# Altium project EVSE_Controller_v0.1.PrjPcb
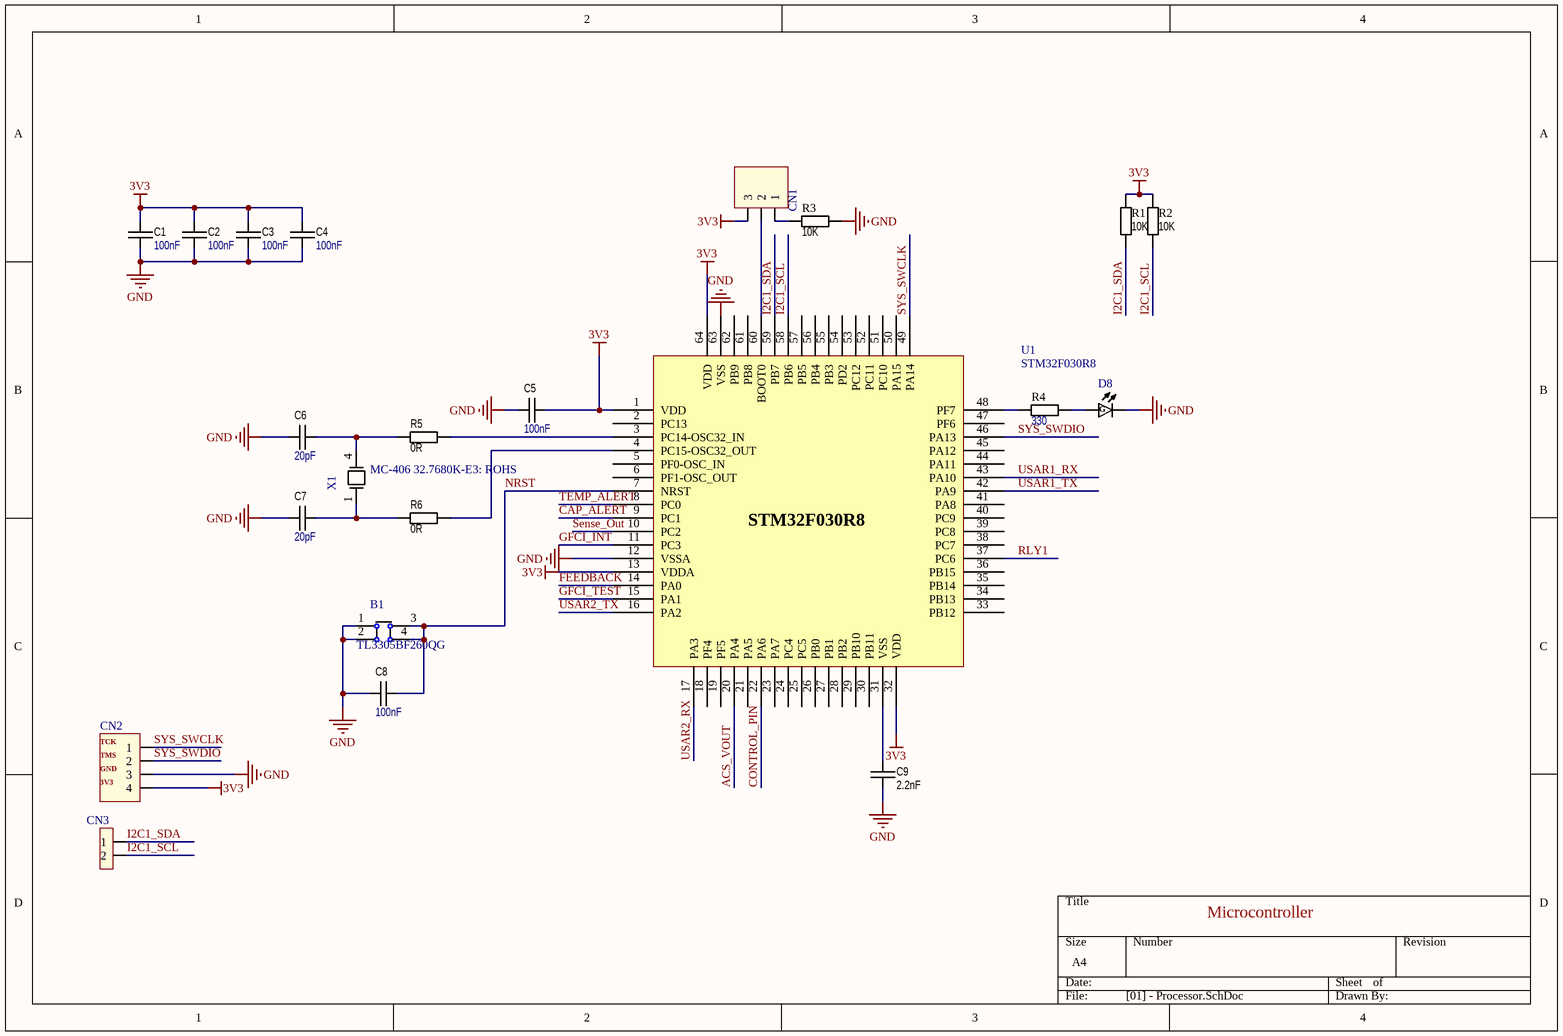
[diagram p0: [01] - Processor.SchDoc]
Date: 2/2/2020; Logo: mfrknyl; Version: v0.1
4 sheets, 135 parts. Net scope: global (net labels, ports and power ports of the same name join across sheets).
Board file: PCB_v0.4.PcbDoc
Sheets:
  [01] - Processor.SchDoc
  [02] - Power_Supplies.SchDoc
  [03] - General_Part.SchDoc
  [04] - IC_Power_Monitor_v0.2.SchDoc

## Sheet [01] - Processor.SchDoc
size A4

### Parts
B1  TL3305BF260QG  [Switch]
C1  value 100nF  [CAP 0603/1608]  (hidden comment: CAP CER 1UF 16V X5R 0603)
C2  value 100nF  [CAP 0603/1608]  (hidden comment: CAP CER 1UF 16V X5R 0603)
C3  value 100nF  [CAP 0603/1608]  (hidden comment: CAP CER 1UF 16V X5R 0603)
C4  value 100nF  [CAP 0603/1608]  (hidden comment: CAP CER 1UF 16V X5R 0603)
C5  value 100nF  [CAP 0603/1608]  (hidden comment: CAP CER 1UF 16V X5R 0603)
C6  value 20pF  [CAP 0603/1608]  (hidden comment: CAPC_20pF_0603_50V)
C7  value 20pF  [CAP 0603/1608]  (hidden comment: CAPC_20pF_0603_50V)
C8  value 100nF  [CAP 0603/1608]  (hidden comment: CAP CER 1UF 16V X5R 0603)
C9  value 2.2nF  [CAP 0603/1608]  (hidden comment: C0603C222K5RACTU)
CN1  87220-3  [Terminal_3]  (value not drawn)  (no BOM)
CN2  61300411121  [Terminal_4]  (value not drawn)  (no BOM)
CN3  5-146280-2  [Terminal_2]  (value not drawn)  (no BOM)
D8  SML-D12M8WT86  [LED-0603]  (value not drawn)
R1  value 10K  [R0603]  (hidden comment: ESR03EZPF1002)
R2  value 10K  [R0603]  (hidden comment: ESR03EZPF1002)
R3  value 10K  [R0603]  (hidden comment: ESR03EZPF1002)
R4  value 330  [R0603]  (hidden comment: RES SMD 330 OHM 1% 1/10W 060)
R5  value 0R  [R0603]  (hidden comment: RES 0R 0603 JUMPER)
R6  value 0R  [R0603]  (hidden comment: RES 0R 0603 JUMPER)
U1  STM32F030R8  [STM-LQFP64]
X1  MC-406 32.7680K-E3: ROHS  [XTAL_ABS25-32.768KHZ-6-T]

### Nets
3V3: C1.1 C2.1 C3.1 C4.1 C5.2 CN1.3 CN2.4 R1.1 R2.1 U1.1(VDD) U1.13(VDDA) U1.32(VDD) U1.64(VDD)
GND: B1.1 B1.2 C1.2 C2.2 C3.2 C4.2 C5.1 C6.1 C7.1 C8.1 C9.2 CN2.3 D8.1 R3.1 U1.12(VSSA) U1.63(VSS)
ACS_VOUT: U1.20(PA4)
CAP_ALERT: U1.9(PC1)
CONTROL_PIN: U1.22(PA6)
FEEDBACK: U1.14(PA0)
GFCI_INT: U1.11(PC3)
GFCI_TEST: U1.15(PA1)
I2C1_SCL: CN3.2 R2.2 U1.58(PB6)
I2C1_SDA: CN3.1 R1.2 U1.59(PB7)
NRST: B1.3 B1.4 C8.2 U1.7(NRST)
RLY1: U1.37(PC6)
Sense_Out: U1.10(PC2)
SYS_SWCLK: CN2.1 U1.49(PA14)
SYS_SWDIO: CN2.2 U1.46(PA13)
TEMP_ALERT: U1.8(PC0)
USAR1_RX: U1.43(PA10)
USAR1_TX: U1.42(PA9)
USAR2_RX: U1.17(PA3)
USAR2_TX: U1.16(PA2)
NetC6_2: C6.2 R5.1 X1.4
NetC7_2: C7.2 R6.1 X1.1
NetC9_1: C9.1 U1.31(VSS)
NetCN1_1: CN1.1 R3.2
NetCN1_2: CN1.2 U1.60(BOOT0)
NetD8_2: D8.2 R4.2
NetR4_1: R4.1 U1.48(PF7)
NetR5_2: R5.2 U1.3(PC14-OSC32_IN)
NetR6_2: R6.2 U1.4(PC15-OSC32_OUT)

Not connected (* = marked no-connect by the designer): U1 2(PC13) 5(PF0-OSC_IN) 6(PF1-OSC_OUT) 18(PF4) 19(PF5) 21(PA5) 23(PA7) 24(PC4) 25(PC5) 26(PB0) 27(PB1) 28(PB2) 29(PB10) 30(PB11) 33(PB12) 34(PB13) 35(PB14) 36(PB15) 38(PC7) 39(PC8) 40(PC9) 41(PA8) 44(PA11) 45(PA12) 47(PF6) 50(PA15) 51(PC10) 52(PC11) 53(PC12) 54(PD2) 55(PB3) 56(PB4) 57(PB5) 61(PB8) 62(PB9)

### Notes on the sheet
- (near CN2) TCK
- (near CN2) TMS
- (near CN2) GND
- (near CN2) 3V3
- Microcontroller
- (in symbol LED_GREEN) G

### Library data of the parts
B1 = SWITCH: Tactile Switch SPST-NO Top Actuated Surface Mount; Manufacturer: E-Switch; Alternative: *; PartNumber: TL3305BF260QG; Price1: 0.22000; Value: *; Price10: 0.21400; Type: TH; Price100: 0.18790; Footprint: =footprintt; Link: https://www.digikey.com/product-detail/en/e-switch/TL3305BF260QG/EG5354CT-ND/5816199
C1-C5 C8 = CAPC_100NF_0603_50V: 1µF ±10% 16V Ceramic Capacitor X5R 0603 (1608 Metric) /; PartNumber: CC0603KRX5R7BB105; Manufacturer: Yageo; Type: SMD; Package: 0603 (1608 Metric); Price1: 0.11000; Price1000: 0.02217; Link: https://www.digikey.com/product-detail/en/yageo/CC0603KRX5R7BB105/311-1444-1-ND/2833750; Tolerance: ±10%; Price100: 0.03820; Voltage: 16V; Price10: 0.08100
C6 C7 = CAPC_20pF_0603_50V: PartNumber: CC0603JRNPO9BN200; Manufacturer: Yageo; Type: SMD; Tolerance: ±5%; Voltage: 50V; Package: 0603 (1608 Metric); Price1: 0.10000; Price1000: 0.01152; Link: https://www.digikey.com/product-detail/en/yageo/CC0603JRNPO9BN200/311-1424-1-ND/2833730; Price100: 0.02050; Price10: 0.04600
C9 = CAPC_2.2uF_0603_50V: Manufacturer: KEMET; Type: SMD; Tolerance: ±10%; Voltage: 50V; Package: 0603; PartNumber: C0603C222K5RACTU; Price1: 0.10000; Price1000: 0.01044; Link: https://www.digikey.com/product-detail/en/kemet/C0603C222K5RACTU/399-1085-1-ND/411360; Price100: 0.04200
CN1 = CONN_3POS: Connector Header Through Hole 3 position 0.100" (2.54mm); Manufacturer: TE Connectivity AMP Connectors; Availablity: Available; Alternative: *; Package: 0.100" (2.54mm); Type: THT; Link: https://www.digikey.com/product-detail/en/te-connectivity-amp-connectors/87220-3/A26544-ND/298245; PartNumber: 87220-3; Footprint: =Footprint; Price1: 2.57000; Price10: 2.33000; Price100: 1.99710; Price1000: 1.42653; Value: *
CN2 = CONN_4POS: Connector Header Through Hole 4 position 0.100" (2.54mm); Manufacturer: Wurth Electronics Inc.; Availablity: Available; Alternative: *; Package: 0.100" (2.54mm); Type: THT; Link: https://www.digikey.com/product-detail/en/wurth-electronics-inc/61300411121/732-5317-ND/4846827; PartNumber: 61300411121; Footprint: =Footprint; Price1: 0.18000; Price10: 0.15300; Price100: 0.09600; Price1000: 0.08800; Value: *
CN3 = CONN_2POS: Connector Header Through Hole 2 position 0.100" (2.54mm); Manufacturer: TE Connectivity AMP Connectors; Availablity: Available; Alternative: *; Package: 0.100" (2.54mm); Type: THT; Link: https://www.digikey.com/product-detail/en/te-connectivity-amp-connectors/5-146280-2/A121480-ND/2275896; PartNumber: 5-146280-2; Footprint: =Footprint; Price1: 0.36000; Price10: 0.34500; Price100: 0.24140; Price1000: 0.17240; Value: *
D8 = LED_GREEN: Green 572nm LED Indication - Discrete 2.2V 0603 (1608 Metric); Manufacturer: Rohm Semiconductor; Type: SMD; Alternative: *; Footprint: =Footprint; Link: https://www.digikey.com/product-detail/en/rohm-semiconductor/SML-D12M8WT86/511-1578-1-ND/1641810; Package: 0603 (1608 Metric); PartNumber: SML-D12M8WT86; Availability: Available; Price1: 0.33000; Price10: 0.23900; Price100: 0.11340; Price1000: 0.05922; Value: *
R1-R3 = RES_10K: 10 kOhms ±1% 0.25W, 1/4W Chip Resistor 0603 (1608 Metric) Automotive AEC-Q200, Pulse Withstanding Thick Film; Manufacturer: Rohm Semiconductor; Type: SMD; Package: 0603 (1608 Metric); PartNumber: ESR03EZPF1002; Link: https://www.digikey.com/product-detail/en/rohm-semiconductor/ESR03EZPF1002/RHM10KADCT-ND/1983753; Price1: 0.13000; Price1000: 0.02033; Alternative: *; Footprint: =Footprint; Price10: 0.12000; Price100: 0.04620; Availability: Available
R4 = RES_330_0603_1%: 330 Ohms ±1% 0.1W, 1/10W Chip Resistor 0603 (1608 Metric) Moisture Resistant Thick Film; PartNumber: RC0603FR-07330RL; Manufacturer: Yageo; Type: SMD; Package: 0603; Link: https://www.digikey.com/product-detail/en/yageo/RC0603FR-07330RL/311-330HRCT-ND/730109; Price1: 0.10000; Price1000: 0.00421; Price100: 0.00940; Price10: 0.02300; Tolerance: ±1%
R5 R6 = RES_0R_0603_JUMPER: PartNumber: RC0603JR-070RL; Manufacturer: Yageo; Type: SMT; Package: 0603; Link: https://www.digikey.com/product-detail/en/yageo/RC0603JR-070RL/311-0.0GRTR-ND/726675; Price1: 0.1; Price1000: 0.00396; Price10: 0.022; Price100: 0.0088
U1 = STM32F030R8: ARM® Cortex®-M0 STM32F0 Microcontroller IC 32-Bit 48MHz 64KB (64K x 8) FLASH 64-LQFP (10x10); PartNumber: STM32F030R8T6TR; Manufacturer: STMicroelectronics; ComponentLink1Description: Manufacturer URL; ComponentLink1URL: http://www.st.com/web/en/home.html; ComponentLink2Description: Datasheet; ComponentLink2URL: http://www.st.com/st-web-ui/static/active/en/resource/technical/document/datasheet/DM00088500.pdf; ComponentLink3Description: Package Specification; ComponentLink3URL: http://www.st.com/st-web-ui/static/active/en/resource/technical/document/datasheet/DM00088500.pdf; Alternative: *; Package: 64-LQFP (10x10); Price1000: 1.22426; Price1: 2.06000; Price100: 1.49010; Price10: 1.85400; Type: SMD; Value: *; Link: https://www.digikey.com/product-detail/en/stmicroelectronics/STM32F030R8T6TR/497-17335-1-ND/7804399
X1 = MC-406 32.7680K-E3: ROHS: 32.768kHz ±20ppm Crystal 6pF 35 kOhms 4-SOJ, 2.29mm pitch /; Manufacturer: EPSON; Alternative: *; Package: 4-SOJ; Price100: 0.81510; Type: SMD; Price1: 1.12000; PartNumber: MC-406 32.7680K-E3: ROHS; Price10: 0.98700; Price1000: 0.81510; Value: *; Availability: *; Footprint: =Footprintt; Link: https://www.digikey.com/product-detail/en/epson/MC-406-32.7680K-E3-ROHS/SER4315CT-ND/7932302

## Sheet [02] - Power_Supplies.SchDoc
size A4
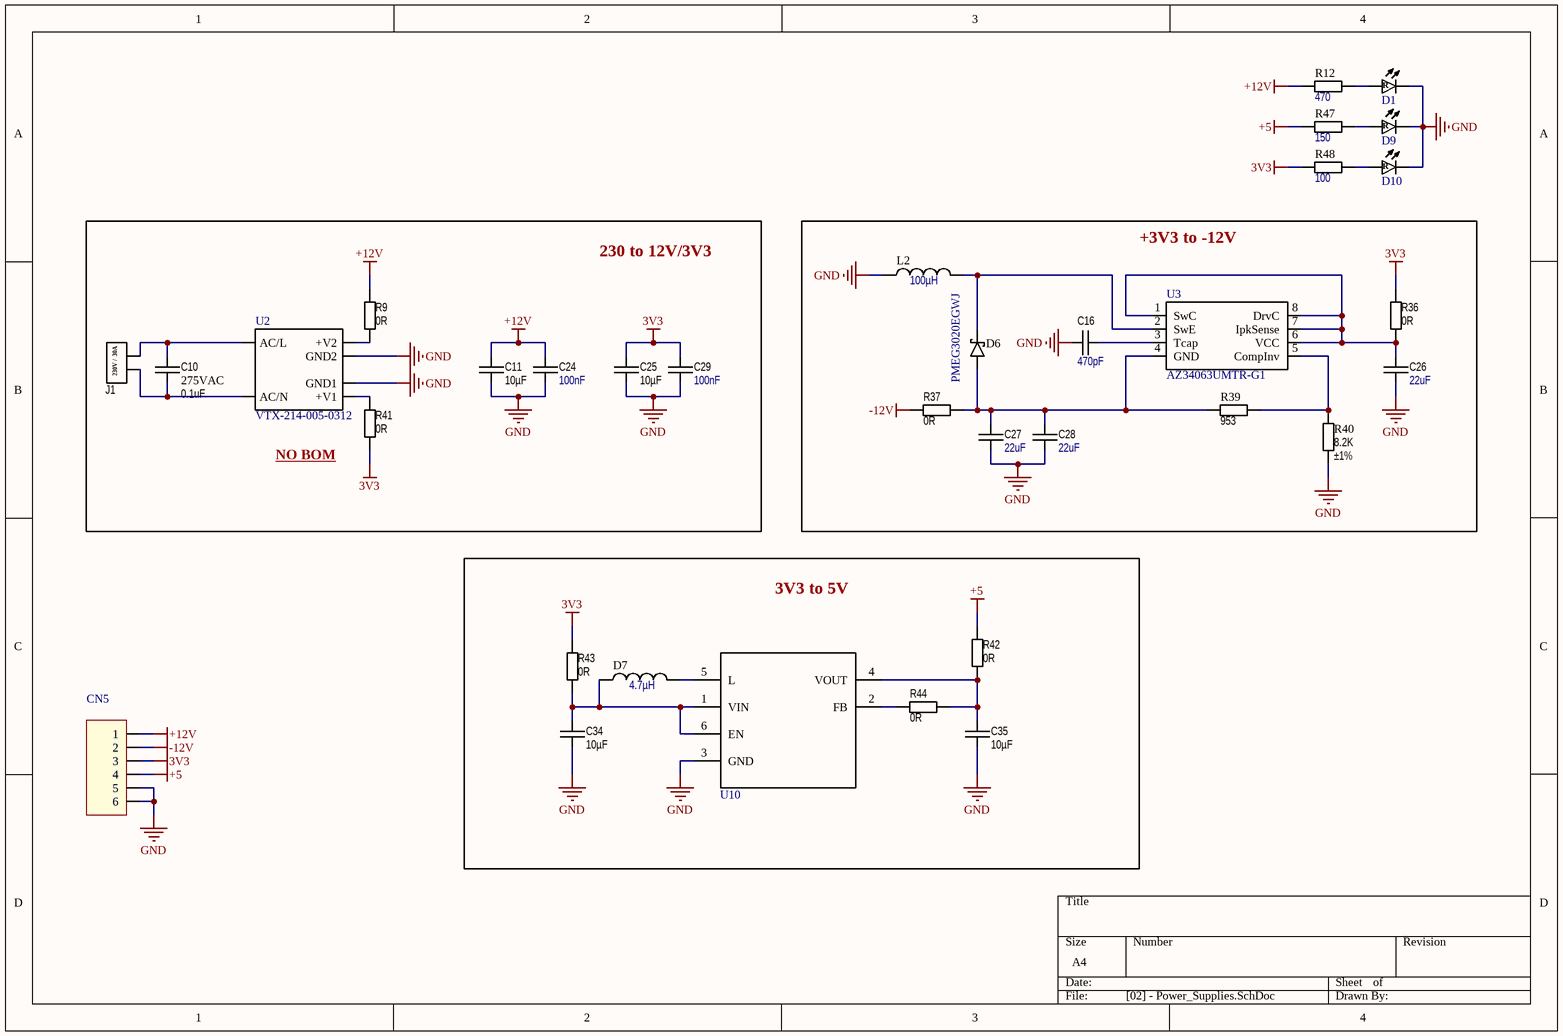
[diagram p1: [02] - Power_Supplies.SchDoc]

### Parts
C10  value 0.1uF  Voltage: 275VAC  [ECQL]  (hidden comment: ECQ-U2A104ML)
C11  value 10µF  [CAP 0603/1608]  (hidden comment: GRM188R61E106MA73D)
C16  value 470pF  [CAP 0603/1608]  (hidden comment: CAP CER 470PF 50V X7R 0603)
C24  value 100nF  [CAP 0603/1608]  (hidden comment: CAP CER 1UF 16V X5R 0603)
C25  value 10µF  [CAP 0603/1608]  (hidden comment: GRM188R61E106MA73D)
C26  value 22uF  [CAP 0603/1608]  (hidden comment: CAP CER 22UF 6.3V X5R 0603)
C27  value 22uF  [CAP 0603/1608]  (hidden comment: CAP CER 22UF 6.3V X5R 0603)
C28  value 22uF  [CAP 0603/1608]  (hidden comment: CAP CER 22UF 6.3V X5R 0603)
C29  value 100nF  [CAP 0603/1608]  (hidden comment: CAP CER 1UF 16V X5R 0603)
C34  value 10µF  [CAP 0603/1608]  (hidden comment: GRM188R61E106MA73D)
C35  value 10µF  [CAP 0603/1608]  (hidden comment: GRM188R61E106MA73D)
CN5  61300411121  [Terminal_6]  (value not drawn)  (no BOM)
D1  SML-D12U1WT86  [LED-0603]  (value not drawn)
D6  PMEG3020EGWJ  [SOD123]
D7  value 4.7µH  [IND_LQH2HPN4R7MJRL]  (hidden comment: LQH2HPN4R7MJRL)
D9  SML-D12U1WT86  [LED-0603]  (value not drawn)
D10  SML-D12U1WT86  [LED-0603]  (value not drawn)
J1  1868076  [30Amp_Connector]  (value not drawn)
L2  value 100µH  [IND_1210]  (hidden comment: FIXED IND 100UH 150MA 1.4 OHM)
R9  value 0R  [R0603]  (hidden comment: RES 0R 0603 JUMPER)
R12  value 470  [R0603]  (hidden comment: RES SMD 470 OHM 1% 1/10W 0603)
R36  value 0R  [R0603]  (hidden comment: RES 0R 0603 JUMPER)
R37  value 0R  [R0603]  (hidden comment: RES 0R 0603 JUMPER)
R39  value 953  [R0603]  (hidden comment: RC0603FR-07953RL)
R40  value 8.2K  Tolerance: ±1%  [R0603]  (hidden comment: RES SMD 8.2K OHM 1% 1/8W 0603)
R41  value 0R  [R0603]  (hidden comment: RES 0R 0603 JUMPER)
R42  value 0R  [R0603]  (hidden comment: RES 0R 0603 JUMPER)
R43  value 0R  [R0603]  (hidden comment: RES 0R 0603 JUMPER)
R44  value 0R  [R0603]  (hidden comment: RES 0R 0603 JUMPER)
R47  value 150  [R0603]  (hidden comment: RES SMD 150 OHM 5% 1/10W 0603)
R48  value 100  [R0603]  (hidden comment: RES SMD 100 OHM 1% 1/10W 0603)
U2  VTX-214-005-0312  [AC-DC_VTX]  (no BOM)
U3  AZ34063UMTR-G1  [SOIC-8]
U10  TPS61222DCKR  [SC-70-6]  (value not drawn)

### Blocks framed on the sheet
230 to 12V/3V3: C10 C11 C24 C25 C29 J1 R9 R41 U2
+3V3 to -12V: C16 C26-C28 D6 L2 R36 R37 R39 R40 U3
3V3 to 5V: C34 C35 D7 R42-R44 U10

### Nets
3V3: C25.1 C29.1 CN5.3 R36.2 R41.1 R43.1 R48.1
+5: CN5.4 R42.1 R47.1
+12V: C11.1 C24.1 CN5.1 R9.2 R12.1
-12V: CN5.2 R37.1
GND: C11.2 C16.1 C24.2 C25.2 C26.1 C27.1 C28.1 C29.2 C34.2 C35.2 CN5.5 CN5.6 D1.1 D9.1 D10.1 L2.1 R40.2 U2.3(GND1) U2.5(GND2) U10.3(GND)
NetC10_1: C10.1 J1.1 U2.2(AC/N)
NetC10_2: C10.2 J1.2 U2.1(AC/L)
NetC16_2: C16.2 U3.3(Tcap)
NetC26_2: C26.2 R36.1 U3.1(SwC) U3.6(VCC) U3.7(IpkSense) U3.8(DrvC)
NetC27_2: C27.2 C28.2 D6.A R37.2 R39.1 U3.4(GND)
NetC34_1: C34.1 D7.1 R43.2 U10.1(VIN) U10.6(EN)
NetC35_1: C35.1 R42.2 R44.2 U10.4(VOUT)
NetD1_2: D1.2 R12.2
NetD6_C: D6.C L2.2 U3.2(SwE)
NetD7_2: D7.2 U10.5(L)
NetD9_2: D9.2 R47.2
NetD10_2: D10.2 R48.2
NetR9_1: R9.1 U2.6(+V2)
NetR39_2: R39.2 R40.1 U3.5(CompInv)
NetR41_2: R41.2 U2.4(+V1)
NetR44_1: R44.1 U10.2(FB)

### Notes on the sheet
- NO BOM
- (in symbol LED_RED) R
- (in symbol TERM_BLK_02_30A) 230V /  30A

### Library data of the parts
C10 = CAPC_0.1uF_RADIAL_275VAC: 0.1µF Film Capacitor 275V  Polyester, Metallized Radial; Manufacturer: Panasonic Electronic Components; Type: TH; Tolerance: ±20%; Package: Radial; PartNumber: ECQ-U2A104ML; Price1: 0.39000; Price1000: 0.10165; Link: https://www.digikey.com/product-detail/en/panasonic-electronic-components/ECQ-U2A104ML/P10730-ND/281393; Price100: 0.16050; Price10: 0.26800
C11 C25 C34 C35 = CAPC_10uF_0603_25V: 10µF ±20% 25V Ceramic Capacitor X5R 0603 (1608 Metric); Manufacturer: Murata Electronics; Type: SMD; Package: 0603; PartNumber: GRM188R61E106MA73D; Price1: 0.42000; Price1000: 0.11123; Link: https://www.digikey.com/product-detail/en/murata-electronics/GRM188R61E106MA73D/490-7202-1-ND/3900486; Tolerance: ±20%; Price100: 0.17560; Voltage: 25V; Price10: 0.29300
C16 = CAPC_470pF_0603_50V: 470pF ±10% 50V Ceramic Capacitor X7R 0603 (1608 Metric); PartNumber: CC0603KRX7R9BB471; Manufacturer: Yageo; Type: SMD; Package: 0603 (1608 Metric); Price1: 0.10000; Price1000: 0.01188; Link: https://www.digikey.com/product-detail/en/yageo/CC0603KRX7R9BB471/311-1078-1-ND/302988; Tolerance: ±10%; Price100: 0.02120; Voltage: 50V; Price10: 0.04800
C24 C29 = CAPC_100NF_0603_50V: as C1 on sheet [01] - Processor; Package: 0603 (1608 Metric); Price1: 0.11000; Price1000: 0.02217; Link: https://www.digikey.com/product-detail/en/yageo/CC0603KRX5R7BB105/311-1444-1-ND/2833750; Tolerance: ±10%; Price100: 0.03820; Voltage: 16V; Price10: 0.08100
C26-C28 = CAPC_22uF_0603_6.3V: 22µF ±20% 6.3V Ceramic Capacitor X5R 0603 (1608 Metric); PartNumber: GRM188R60J226MEA0D; Manufacturer: Murata Electronics; Type: SMD; Package: 0603; Price1: 0.26000; Price1000: 0.06176; Link: https://www.digikey.com/product-detail/en/murata-electronics/GRM188R60J226MEA0D/490-7611-1-ND/4280544; Tolerance: ±20%; Price100: 0.10000; Voltage: 6.3V; Price10: 0.17600
CN5 = CONN_6POS: Connector Header Through Hole 4 position 0.100" (2.54mm); Manufacturer: Wurth Electronics Inc.; Availablity: Available; Alternative: *; Package: 0.100" (2.54mm); Type: THT; Link: https://www.digikey.com/product-detail/en/wurth-electronics-inc/61300411121/732-5317-ND/4846827; PartNumber: 61300411121; Footprint: =Footprint; Price1: 0.18000; Price10: 0.15300; Price100: 0.09600; Price1000: 0.08800; Value: *
D1 D9 D10 = LED_RED: Red 620nm LED Indication - Discrete 2.2V 0603 (1608 Metric); Manufacturer: Rohm Semiconductor; Type: SMD; Alternative: *; Footprint: =Footprint; Link: https://www.digikey.com/product-detail/en/rohm-semiconductor/SML-D12U1WT86/SML-D12U1WT86CT-ND/5843858; Package: 0603 (1608 Metric); PartNumber: SML-D12U1WT86; Availability: Available; Price1: 0.21000; Price10: 0.15500; Price100: 0.07330; Price1000: 0.03826; Value: *
D6 = DIODE_PMEG: Diode Schottky 30V 2A Surface Mount SOD-123; Manufacturer: Nexperia USA Inc.; Type: SMD; Value: 30V 2A; Package: SOD-123; PartNumber: PMEG3020EGWJ; Link: https://www.digikey.com/product-detail/en/nexperia-usa-inc/PMEG3020EGWJ/1727-7332-1-ND/7390583; Price1: 0.39000; Price1000: 0.08269; Alternative: *; Footprint: =Footprint; Price10: 0.28800; Price100: 0.13660; Availability: Available
D7 = IND_4.7uH_170mOhm _Murata: 4.7µH Shielded Wirewound Inductor 770mA 204mOhm Max 1008 (2520 Metric); Manufacturer: Murata Electronics; Type: SMD; Package: 1008 (2520 Metric); PartNumber: LQH2HPN4R7MJRL; Link: https://www.digikey.com/product-detail/en/murata-electronics/LQH2HPN4R7MJRL/490-9904-2-ND/5018243; Price1: 0.17046; Price1000: 0.15152; Alternative: *; Footprint: =Footprint; Price10: 0.15152; Price100: 0.15152; Availability: Available
J1 = TERM_BLK_02_30A: 2 Position Wire to Board Terminal Block Horizontal with Board 0.300" (7.62mm) Through Hole; Manufacturer: Phoenix Contact; Type: TH; PartNumber: 1868076; Link: https://www.digikey.com/product-detail/en/phoenix-contact/1868076/277-5840-ND/2511066; Price1: 1.71000; Price100: 1.42740; Footprint: =Footprint; Price10: 1.66000; Price1000: 1.17914
L2 = IND_100uH: 100µH Unshielded Wirewound Inductor 150mA 1.4Ohm 1210 (3225 Metric); PartNumber: LBC3225T101KR; Manufacturer: Taiyo Yuden; Type: SMD; Package: 1210 (3225 Metric); Link: https://www.digikey.com/product-detail/en/taiyo-yuden/LBC3225T101KR/587-2422-1-ND/2230288; Price1: 0.21000; Price1000: 0.10350; Alternative: *; Footprint: =Footprint; Price10: 0.18600; Price100: 0.12420; Availability: Available
R9 R36 R37 R41-R44 = RES_0R_0603_JUMPER: as R5 on sheet [01] - Processor; Type: SMT; Package: 0603; Link: https://www.digikey.com/product-detail/en/yageo/RC0603JR-070RL/311-0.0GRTR-ND/726675; Price1: 0.1; Price1000: 0.00396; Price10: 0.022; Price100: 0.0088
R12 = RES_470_0603_1%_1: 470 Ohms ±1% 0.1W, 1/10W Chip Resistor 0603 (1608 Metric) Moisture Resistant Thick Film; PartNumber: RC0603FR-07470RL; Manufacturer: Yageo; Type: SMD; Package: 0603; Link: https://www.digikey.com/product-detail/en/yageo/RC0603FR-07470RL/311-470HRCT-ND/730203; Price1: 0.10000; Price1000: 0.00421; Price100: 0.00940; Price10: 0.02300; Tolerance: ±1%
R39 = RES_953: 953 Ohms ±1% 0.1W, 1/10W Chip Resistor 0603 (1608 Metric) Moisture Resistant Thick Film; Manufacturer: Yageo; Type: SMD; Package: 0603 (1608 Metric); PartNumber: RC0603FR-07953RL; Link: https://www.digikey.com/product-detail/en/yageo/RC0603FR-07953RL/311-953HRCT-ND/730384; Price1: 0.10000; Price1000: 0.00421; Alternative: *; Footprint: =Footprint; Price10: 0.02300; Price100: 0.02300; Availability: Available
R40 = RES_8K2_0603_1%: 8.2 kOhms ±1% 0.125W, 1/8W Chip Resistor 0603 (1608 Metric) Anti-Sulfur Thin Film; PartNumber: MCT06030C8201FP500; Manufacturer: Vishay Beyschlag; Type: SMD; Package: 0603 (1608 Metric); Link: https://www.digikey.com/product-detail/en/yageo/RC0603JR-074K7L/311-4.7KGRTR-ND/726785; Price1: 0.17000; Price1000: 0.02376; Price100: 0.05680; Price10: 0.14500
R47 = RES_150_0603_5%: 150 Ohms ±5% 0.1W, 1/10W Chip Resistor 0603 (1608 Metric) Moisture Resistant Thick Film; PartNumber: RC0603JR-07150RL; Manufacturer: Yageo; Type: SMD; Package: 0603; Link: https://www.digikey.com/product-detail/en/yageo/RC0603JR-07150RL/311-150GRCT-ND/729661; Price1: 0.10000; Price1000: 0.00347; Tolerance: ±5%; Price10: 0.01900; Price100: 0.00770
R48 = RES_100_0603_1%: 100 Ohms ±1% 0.1W, 1/10W Chip Resistor 0603 (1608 Metric) Moisture Resistant Thick Film; PartNumber: RC0603FR-07100RL; Manufacturer: Yageo; Type: SMD; Package: 0603; Link: https://www.digikey.com/product-detail/en/yageo/RC0603FR-07100RL/311-100HRCT-ND/729835; Price1: 0.10000; Price1000: 0.00421; Price100: 0.00940; Price10: 0.02300; Tolerance: ±1%
U2 = AC/DC-VTX: VTX-214-005-0312 -  AC / DC PCB Mount Power Supply (PSU), ITE, 2 Output, 5W, 3.3V, 757mA, 12V; Manufacturer: VIGORTRONIX; Alternative: *; Footprint: =Footprint; Link: https://lt.farnell.com/vigortronix/vtx-214-005-0312/power-supply-ac-dc-3-3v-0-757a/dp/2627172; PartNumber: VTX-214-005-0312; Type: TH; Price1: 14.22; Price10: 9.08; Price100: 7.89; Price1000: 7.89; Value: *
U3 = IC_REG: Buck, Boost Switching Regulator IC Positive or Negative Adjustable 1.25V 1 Output 1.5A (Switch) 8-SOIC (0.154", 3.90mm Width); Manufacturer: Diodes Incorporated; Footprint: =Footprint; Link: https://www.digikey.com/product-detail/en/diodes-incorporated/AZ34063UMTR-G1/AZ34063UMTR-G1DICT-ND/4505211; Package: 8-SOIC; PartNumber: AZ34063UMTR-G1; Price1: 0.48000; Price10: 0.38700; Price100: 0.23890; Price1000: 0.13591; Type: TH; Value: *
U10 = IC_REG_BOOST: Boost Switching Regulator IC Positive Fixed 5V 1 Output 200mA (Switch) 6-TSSOP, SC-88, SOT-363; Manufacturer: Texas Instruments; Alternative: *; Package: SC-70; Price1000: 0.48163; PartNumber: TPS61222DCKR; Price1: 1.14000; Value: *; Price10: 1.01500; Type: SMD; Price100: 0.73960; Footprint: =footprintt; Link: https://www.digikey.com/product-detail/en/texas-instruments/TPS61222DCKR/296-39435-1-ND/5143383

## Sheet [03] - General_Part.SchDoc
size A4
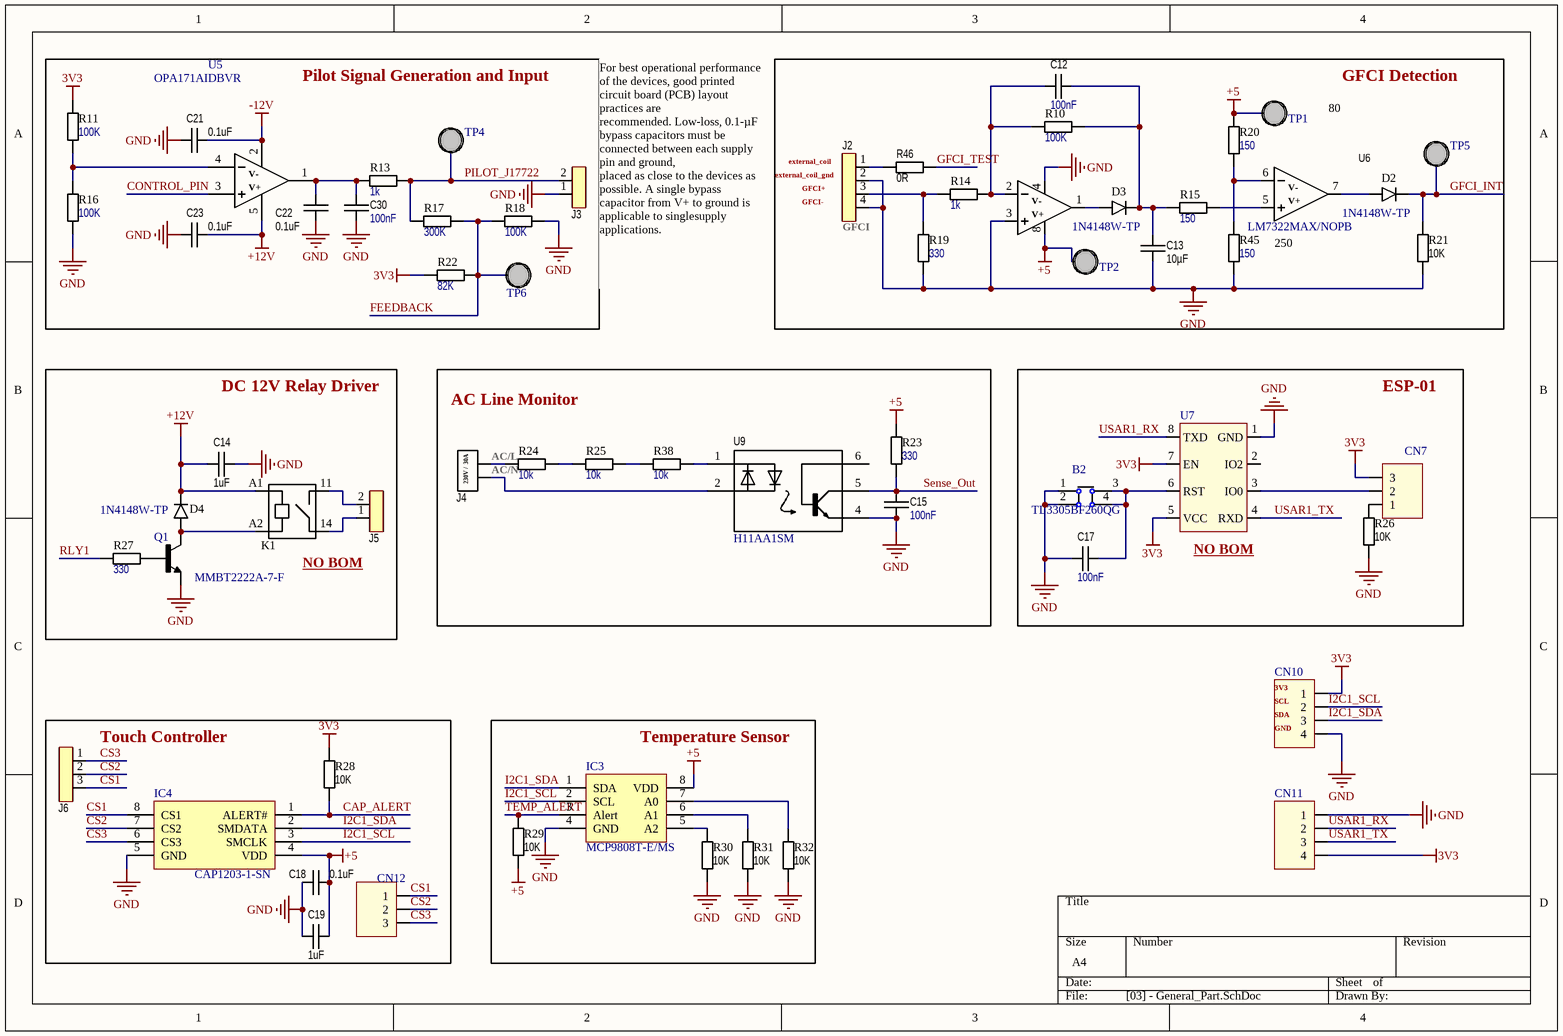
[diagram p2: [03] - General_Part.SchDoc]

### Parts
B2  TL3305BF260QG  [Switch]
C12  value 100nF  [CAP 0603/1608]  (hidden comment: CAP CER 1UF 16V X5R 0603)
C13  value 10µF  [CAP 0603/1608]  (hidden comment: GRM188R61E106MA73D)
C14  value 1uF  [CAP 0603/1608]  (hidden comment: CAP CER 1UF 25V X5R 0603)
C15  value 100nF  [CAP 0603/1608]  (hidden comment: CAP CER 1UF 16V X5R 0603)
C17  value 100nF  [CAP 0603/1608]  (hidden comment: CAP CER 1UF 16V X5R 0603)
C18  value 0.1uF  [CAP 0603/1608]  (hidden comment: C0603C104M5RACTU)
C19  value 1uF  [CAP 0603/1608]  (hidden comment: CAP CER 1UF 25V X5R 0603)
C21  value 0.1uF  [CAP 0603/1608]  (hidden comment: C0603C104M5RACTU)
C22  value 0.1uF  [CAP 0603/1608]  (hidden comment: C0603C104M5RACTU)
C23  value 0.1uF  [CAP 0603/1608]  (hidden comment: C0603C104M5RACTU)
C30  value 100nF  [CAP 0603/1608]  (hidden comment: CAP CER 1UF 16V X5R 0603)
CN7  87220-3  [Terminal_3]  (value not drawn)  (no BOM)
CN10  61300411121  [Terminal_4]  (value not drawn)  (no BOM)
CN11  61300411121  [Terminal_4]  (value not drawn)  (no BOM)
CN12  87220-3  [Terminal_3]  (value not drawn)  (no BOM)
D2  1N4148W-TP  [SOD123]
D3  1N4148W-TP  [SOD123]
D4  1N4148W-TP  [SOD123]
IC3  MCP9808T-E/MS  [MSOP-8]
IC4  CAP1203-1-SN  [SOIC-8]
J2  1985218  [BLK_04P_3.5MM]  (value not drawn)
J3  1985195  [BLK_02P_3.5MM]  (value not drawn)
J4  1868076  [30Amp_Connector]  (value not drawn)
J5  1985195  [BLK_02P_3.5MM]  (value not drawn)
J6  1995279  [BLK_03P_3.5MM]  (value not drawn)
K1  PCN-112D3MHZ,000  [Relay_PCN]  (value not drawn)  (no BOM)
Q1  MMBT2222A-7-F  [SOT23-3]
R10  value 100K  [R0603]  (hidden comment: RES SMD 100K OHM 0.1% 1/10W 0603)
R11  value 100K  [R0603]  (hidden comment: RES SMD 100K OHM 0.1% 1/10W 0603)
R13  value 1k  [R0603]  (hidden comment: RES SMD 1K OHM 5% 1/10W 0603)
R14  value 1k  [R0603]  (hidden comment: RES SMD 1K OHM 5% 1/10W 0603)
R15  value 150  [R0603]  (hidden comment: RES SMD 150 OHM 5% 1/10W 0603)
R16  value 100K  [R0603]  (hidden comment: RES SMD 100K OHM 0.1% 1/10W 0603)
R17  value 300K  [R0603]  (hidden comment: RES SMD 300K OHM 5% 1/10W 0603)
R18  value 100K  [R0603]  (hidden comment: RES SMD 100K OHM 0.1% 1/10W 0603)
R19  value 330  [R0603]  (hidden comment: RES SMD 330 OHM 1% 1/10W 060)
R20  value 150  [R0603]  (hidden comment: RES SMD 150 OHM 5% 1/10W 0603)
R21  value 10K  [R0603]  (hidden comment: ESR03EZPF1002)
R22  value 82K  [R0603]  (hidden comment: RES SMD 82K OHM 0.1% 1/10W 0603)
R23  value 330  [R0603]  (hidden comment: RES SMD 330 OHM 1% 1/10W 060)
R24  value 10k  [R1206]  (hidden comment: RES SMD 10K OHM 1% 1/4W 1206)
R25  value 10k  [R1206]  (hidden comment: RES SMD 10K OHM 1% 1/4W 1206)
R26  value 10K  [R0603]  (hidden comment: ESR03EZPF1002)
R27  value 330  [R0603]  (hidden comment: RES SMD 330 OHM 1% 1/10W 060)
R28  value 10K  [R0603]  (hidden comment: ESR03EZPF1002)
R29  value 10K  [R0603]  (hidden comment: ESR03EZPF1002)
R30  value 10K  [R0603]  (hidden comment: ESR03EZPF1002)
R31  value 10K  [R0603]  (hidden comment: ESR03EZPF1002)
R32  value 10K  [R0603]  (hidden comment: ESR03EZPF1002)
R38  value 10k  [R1206]  (hidden comment: RES SMD 10K OHM 1% 1/4W 1206)
R45  value 150  [R0603]  (hidden comment: RES SMD 150 OHM 5% 1/10W 0603)
R46  value 0R  [R0603]  (hidden comment: RES 0R 0603 JUMPER)
TP1  Test_Point  [TP]  (value not drawn)  (no BOM)
TP2  Test_Point  [TP]  (value not drawn)  (no BOM)
TP4  Test_Point  [TP]  (value not drawn)  (no BOM)
TP5  Test_Point  [TP]  (value not drawn)  (no BOM)
TP6  Test_Point  [TP]  (value not drawn)  (no BOM)
U5  OPA171AIDBVR  [SOT-23-5]
U6  LM7322MAX/NOPB  [SOIC-8]
U7  317060016  [Terminal_ESP]  (value not drawn)  (no BOM)
U9  H11AA1SM  [6-SMD]

### Blocks framed on the sheet
Pilot Signal Generation and Input: C21-C23 C30 J3 R11 R13 R16-R18 R22 TP4 TP6 U5
GFCI Detection: C12 C13 D2 D3 J2 R10 R14 R15 R19-R21 R45 R46 TP1 TP2 TP5 U6
DC 12V Relay Driver: C14 D4 J5 K1 Q1 R27
AC Line Monitor: C15 J4 R23-R25 R38 U9
ESP-01: B2 C17 CN7 R26 U7
Touch Controller: C18 C19 CN12 IC4 J6 R28
Temperature Sensor: IC3 R29-R32

### Nets
3V3: CN7.3 CN10.1 CN11.4 R11.1 R22.1 R28.1 U7.5(VCC) U7.7(EN)
+5: C18.2 C19.2 IC3.8(VDD) IC4.4(VDD) R20.1 R23.1 R29.2 TP1.1 TP2.1 U6.8(V+)
+12V: C14.1 C23.1 D4.C K1.A1 U5.5(VDD)
-12V: C21.1 U5.2(GND)
GND: B2.1 B2.2 C13.2 C14.2 C15.2 C17.1 C18.1 C19.1 C21.2 C22.2 C23.2 C30.2 CN10.4 CN11.1 IC3.4(GND) IC4.5(GND) J2.2 J2.4 J3.1 Q1.E R16.2 R18.2 R19.2 R21.2 R26.1 R30.2 R31.2 R32.2 R45.2 U6.3(INA+) U6.4(V-) U7.1(GND) U9.4(E)
CAP_ALERT: IC4.1(ALERT#) R28.2
CONTROL_PIN: U5.3(IN+)
CS1: CN12.1 IC4.8(CS1) J6.3
CS2: CN12.2 IC4.7(CS2) J6.2
CS3: CN12.3 IC4.6(CS3) J6.1
FEEDBACK: R17.2 R18.1 R22.2 TP6.1
GFCI_INT: D2.C R21.1 TP5.1
GFCI_TEST: R46.2
I2C1_SCL: CN10.2 IC3.2(SCL) IC4.3(SMCLK)
I2C1_SDA: CN10.3 IC3.1(SDA) IC4.2(SMDATA)
PILOT_J17722: J3.2 R13.2 R17.1 TP4.1
RLY1: R27.1
Sense_Out: C15.1 R23.2 U9.5(C)
TEMP_ALERT: IC3.3(Alert) R29.1
USAR1_RX: CN11.2 U7.8(TXD)
USAR1_TX: CN11.3 U7.4(RXD)
NetB2_3: B2.3 B2.4 C17.2 U7.6(RST)
NetC12_1: C12.1 R10.1 R14.2 U6.2(INA-)
NetC12_2: C12.2 C13.1 D3.C R10.2 R15.1
NetC22_1: C22.1 C30.1 R13.1 U5.1(1OUT)
NetCN7_1: CN7.1 R26.2
NetCN7_2: CN7.2 U7.3(IO0)
NetD2_A: D2.A U6.7(OUTB)
NetD3_A: D3.A U6.1(OUTA)
NetD4_A: D4.A K1.A2 Q1.C
NetIC3_5: IC3.5(A2) R30.1
NetIC3_6: IC3.6(A1) R31.1
NetIC3_7: IC3.7(A0) R32.1
NetJ2_1: J2.1 R46.1
NetJ2_3: J2.3 R14.1 R19.1
NetJ4_1: J4.1 U9.2(C/A)
NetJ4_2: J4.2 R24.1
NetJ5_1: J5.1 K1.14
NetJ5_2: J5.2 K1.11
NetQ1_B: Q1.B R27.2
NetR11_2: R11.2 R16.1 U5.4(IN-)
NetR15_2: R15.2 U6.5(INB+)
NetR20_2: R20.2 R45.1 U6.6(INB-)
NetR24_2: R24.2 R25.1
NetR25_2: R25.2 R38.1
NetR38_2: R38.2 U9.1(A/C)

Not connected (* = marked no-connect by the designer): U7 2(IO2); U9 6(B)

### Notes on the sheet
- (near J2) external_coil_gnd
- (near J2) external_coil
- 80
- (near J2) GFCI+
- (near J2) GFCI-
- (near J2) GFCI
- (near J3) For best operational performance of the devices, good printed circuit board (PCB) layout practices are
  recommended. Low-loss, 0.1-µF bypass capacitors must be connected between each supply pin and ground,
  placed as close to the devices as possible. A single bypass capacitor from V+ to ground is applicable to singlesupply applications.
- (near U6) 250
- (near R24) AC/L
- (near R24) AC/N
- (near K1) NO BOM
- (near U7) NO BOM
- (near CN10) 3V3
- (near CN10) SCL
- (near CN10) SDA
- (near CN10) GND
- (in symbol OPA171) V-; V+
- (in symbol TERM_BLK_02_30A) 230V /  30A

### Library data of the parts
B2 = SWITCH: as B1 on sheet [01] - Processor; Alternative: *; PartNumber: TL3305BF260QG; Price1: 0.22000; Value: *; Price10: 0.21400; Type: TH; Price100: 0.18790; Footprint: =footprintt; Link: https://www.digikey.com/product-detail/en/e-switch/TL3305BF260QG/EG5354CT-ND/5816199
C12 C15 C17 C30 = CAPC_100NF_0603_50V: as C1 on sheet [01] - Processor; Package: 0603 (1608 Metric); Price1: 0.11000; Price1000: 0.02217; Link: https://www.digikey.com/product-detail/en/yageo/CC0603KRX5R7BB105/311-1444-1-ND/2833750; Tolerance: ±10%; Price100: 0.03820; Voltage: 16V; Price10: 0.08100
C13 = CAPC_10uF_0603_25V: as C11 on sheet [02] - Power_Supplies; Package: 0603; PartNumber: GRM188R61E106MA73D; Price1: 0.42000; Price1000: 0.11123; Link: https://www.digikey.com/product-detail/en/murata-electronics/GRM188R61E106MA73D/490-7202-1-ND/3900486; Tolerance: ±20%; Price100: 0.17560; Voltage: 25V; Price10: 0.29300
C14 C19 = CAPC_1uF_0603_25V: 1µF ±20% 25V Ceramic Capacitor X5R 0603 (1608 Metric); PartNumber: TMK107BLD105MA-T; Manufacturer: Taiyo Yuden; Type: SMD; Package: 0603 (1608 Metric); Price1: 0.48000; Price1000: 0.20190; Link: https://www.digikey.com/product-detail/en/taiyo-yuden/TMK107BLD105MA-T/587-6297-1-ND/9931835; Tolerance: ±20%; Price100: 0.20190; Voltage: 25V; Price10: 0.33600
C18 C21-C23 = CAPC_0.1uF_0603_50V: 0.1µF ±20% 50V Ceramic Capacitor X7R 0603 (1608 Metric); Manufacturer: KEMET; Type: SMD; Package: 0603; PartNumber: C0603C104M5RACTU; Price1: 0.10000; Price1000: 0.00974; Link: https://www.digikey.com/product-detail/en/kemet/C0603C104M5RACTU/399-7845-1-ND/3471568; Tolerance: ±20%; Price100: 0.01740; Voltage: 50V; Price10: 0.03900
CN7 CN12 = CONN_3POS: as CN1 on sheet [01] - Processor; Alternative: *; Package: 0.100" (2.54mm); Type: THT; Link: https://www.digikey.com/product-detail/en/te-connectivity-amp-connectors/87220-3/A26544-ND/298245; PartNumber: 87220-3; Footprint: =Footprint; Price1: 2.57000; Price10: 2.33000; Price100: 1.99710; Price1000: 1.42653; Value: *
CN10 CN11 = CONN_4POS: as CN2 on sheet [01] - Processor; Alternative: *; Package: 0.100" (2.54mm); Type: THT; Link: https://www.digikey.com/product-detail/en/wurth-electronics-inc/61300411121/732-5317-ND/4846827; PartNumber: 61300411121; Footprint: =Footprint; Price1: 0.18000; Price10: 0.15300; Price100: 0.09600; Price1000: 0.08800; Value: *
D2-D4 = DIODE _100V_150MA: Diode Standard 100V 150mA Surface Mount SOD-123; Manufacturer: Micro Commercial Co; Type: SMD; Package: SOD-123; PartNumber: 1N4148W-TP; Link: https://www.digikey.com/product-detail/en/micro-commercial-co/1N4148W-TP/1N4148WTPMSCT-ND/717311; Price1: 0.10000; Price1000: 0.01854; Alternative: *; Footprint: =Footprint; Price10: 0.08100; Price100: 0.03400
IC3 = MCP9808: Temperature Sensor Digital, Local -40°C ~ 125°C 10 b 8-MSOP; Manufacturer: Microchip Technology; Alternative: *; Footprint: =Footprint; Link: https://www.digikey.com/product-detail/en/microchip-technology/MCP9808T-E-MS/MCP9808T-E-MSCT-ND/5169548; Package: 8MSOP; PartNumber: MCP9808T-E/MS; Type: SMD; Price1: 1.13000; Price10: 0.94000; Price100: 0.94000; Price1000: 0.94000; Value: *
IC4 = CAP1203: Capacitive Touch Buttons 8-SOIC; Manufacturer: Microchip Technology; Alternative: *; Footprint: =Footprint; Link: https://www.digikey.com/product-detail/en/microchip-technology/CAP1203-1-SN/CAP1203-1-SN-ND/5886098; Package: 8-SOIC; PartNumber: CAP1203-1-SN; Price1: 0.50000; Price10: 0.46000; Price100: 0.46000; Price1000: 0.46000; Type: SMD; Value: *
J2 = BLK_04_3.5: 4 Position Wire to Board Terminal Block 45° (135°) Angle with Board 0.138" (3.50mm) Through Hole; Manufacturer: Phoenix Contact; Type: TH; PartNumber: 1985218; Link: https://www.digikey.com/product-detail/en/phoenix-contact/1985218/277-1624-ND/568661; Price1: 0.58000; Price100: 0.51680; Footprint: =Footprint; Price10: 0.55500; Price1000: 0.41055
J3 J5 = BLK_02_3.5: 2 Position Wire to Board Terminal Block 45° (135°) Angle with Board 0.138" (3.50mm) Through Hole; Manufacturer: Phoenix Contact; Type: TH; PartNumber: 1985195; Link: https://www.digikey.com/product-detail/en/phoenix-contact/1985195/277-1622-ND/568659; Price1: 0.32000; Price100: 0.28090; Footprint: =Footprint; Price10: 0.30200; Price1000: 0.22313
J4 = TERM_BLK_02_30A: as J1 on sheet [02] - Power_Supplies; Type: TH; PartNumber: 1868076; Link: https://www.digikey.com/product-detail/en/phoenix-contact/1868076/277-5840-ND/2511066; Price1: 1.71000; Price100: 1.42740; Footprint: =Footprint; Price10: 1.66000; Price1000: 1.17914
J6 = BLK_03_3.5: 3 Position Wire to Board Terminal Block 45° (135°) Angle with Board 0.138" (3.50mm) Through Hole; Manufacturer: Phoenix Contact; Type: TH; PartNumber: 1995279; Link: https://www.digikey.com/product-detail/en/phoenix-contact/1995279/277-14524-ND/2513974; Price1: 0.43000; Price100: 0.38200; Footprint: =Footprint; Price10: 0.41100; Price1000: 0.30350
K1 = RL_PCN: General Purpose Relay SPST-NO (1 Form A) 12VDC Coil Through Hole; Manufacturer: TE Connectivity Potter & Brumfield Relays; Type: TH; Package: Bulk; PartNumber: PCN-112D3MHZ,000; Link: https://www.digikey.com/product-detail/en/te-connectivity-potter-brumfield-relays/PCN-112D3MHZ000/PCN-112D3MHZ000-ND/1128732; Price1000: 2.19452; Footprint: =Footprint; Price10: 2.97000; Price100: 2.37600; Price1: 3.17000
Q1 = NPN_40V_0.6A: Bipolar (BJT) Transistor NPN 40V 600mA 300MHz 310mW Surface Mount SOT-23-3; Manufacturer: Diodes Incorporated; Type: SMD; Alternative: *; Package: SOT23-3; Price1000: 0.02808; PartNumber: MMBT2222A-7-F; Price1: 0.13000; Value: *; Price10: 0.12300; Price100: 0.05150; Footprint: =footprintt; Link: https://www.digikey.com/product-detail/en/diodes-incorporated/MMBT2222A-7-F/MMBT2222A-FDICT-ND/815723
R10 R11 R16 R18 = RES_100k_0603_0.1%: 100 kOhms ±0.1% 0.1W, 1/10W Chip Resistor 0603 (1608 Metric) Thin Film; PartNumber: RT0603BRD07100KL; Manufacturer: Yageo; Type: SMD; Package: 0603; Link: https://www.digikey.com/product-detail/en/yageo/RT0603BRD07100KL/YAG1235CT-ND/4340588; Price1: 0.38000; Price1000: 0.05233; Price100: 0.12500; Price10: 0.32000; Tolerance: ±0.1%
R13 R14 = RES_1k_0603_5%: 1 kOhms ±5% 0.1W, 1/10W Chip Resistor 0603 (1608 Metric) Moisture Resistant Thick Film / Do; PartNumber: RC0603JR-071KL; Manufacturer: Yageo; Type: SMD; Package: 0603; Link: https://www.digikey.com/product-detail/en/yageo/RC0603JR-071KL/311-1.0KGRCT-ND/729624; Price1: 0.10000; Price1000: 0.00347; Price100: 0.00770; Price10: 0.01900; Tolerance: ±5%
R15 R20 R45 = RES_150_0603_5%: as R47 on sheet [02] - Power_Supplies; Type: SMD; Package: 0603; Link: https://www.digikey.com/product-detail/en/yageo/RC0603JR-07150RL/311-150GRCT-ND/729661; Price1: 0.10000; Price1000: 0.00347; Tolerance: ±5%; Price10: 0.01900; Price100: 0.00770
R17 = RES_300K_0603_1%: 300 kOhms ±5% 0.1W, 1/10W Chip Resistor 0603 (1608 Metric) Moisture Resistant Thick Film; PartNumber: RC0603JR-07300KL; Manufacturer: Yageo; Tolerance: ±1%; Type: SMD; Package: 0603; Link: https://www.digikey.com/product-detail/en/yageo/RC0603JR-07300KL/311-300KGRCT-ND/729713; Price1: 0.10000; Price1000: 0.00347; Price100: 0.00770; Price10: 0.01900
R19 R23 R27 = RES_330_0603_1%: as R4 on sheet [01] - Processor; Type: SMD; Package: 0603; Link: https://www.digikey.com/product-detail/en/yageo/RC0603FR-07330RL/311-330HRCT-ND/730109; Price1: 0.10000; Price1000: 0.00421; Price100: 0.00940; Price10: 0.02300; Tolerance: ±1%
R21 R26 R28-R32 = RES_10K: as R1 on sheet [01] - Processor; Type: SMD; Package: 0603 (1608 Metric); PartNumber: ESR03EZPF1002; Link: https://www.digikey.com/product-detail/en/rohm-semiconductor/ESR03EZPF1002/RHM10KADCT-ND/1983753; Price1: 0.13000; Price1000: 0.02033; Alternative: *; Footprint: =Footprint; Price10: 0.12000; Price100: 0.04620; Availability: Available
R22 = RES_82K_0603_0.1%: 82 kOhms ±0.1% 0.1W, 1/10W Chip Resistor 0603 (1608 Metric) Thin Film; PartNumber: RT0603BRD0782KL; Manufacturer: Yageo; Tolerance: ±1%; Type: SMD; Package: 0603; Link: https://www.digikey.com/product-detail/en/yageo/RT0603BRD0782KL/YAG4597CT-ND/6616753; Price1: 0.38000; Price1000: 0.05233; Price10: 0.32000; Price100: 0.12500
R24 R25 R38 = RES_10k_1206_1%: 10 kOhms ±1% 0.25W, 1/4W Chip Resistor 1206 (3216 Metric) Automotive AEC-Q200 Thick Film; PartNumber: ERJ-8ENF1002V; Manufacturer: Panasonic Electronic Components; Type: SMD; Package: 1206 (3216 Metric); Link: digikey.com/product-detail/en/panasonic-electronic-components/ERJ-8ENF1002V/P10.0KFCT-ND/89822; Price1: 0.10000; Price1000: 0.01500; Tolerance: ±1%; Price10: 0.08900; Price100: 0.03410
R46 = RES_0R_0603_JUMPER: as R5 on sheet [01] - Processor; Type: SMT; Package: 0603; Link: https://www.digikey.com/product-detail/en/yageo/RC0603JR-070RL/311-0.0GRTR-ND/726675; Price1: 0.1; Price1000: 0.00396; Price10: 0.022; Price100: 0.0088
U5 = OPA171: General Purpose Amplifier 1 Circuit Rail-to-Rail SOT-23-5; Manufacturer: Texas Instruments; Alternative: *; Package: OPA171 DBV Package; Price1000: 0.57680; PartNumber: OPA171AIDBVR; Price1: 1.36000; Value: *; Price10: 1.21500; Type: SMD; Price100: 0.88580; Footprint: =footprintt; Link: https://www.digikey.com/product-detail/en/texas-instruments/OPA171AIDBVR/296-37698-1-ND/4833926
U6 = OP_LM7322: General Purpose Amplifier 2 Circuit Rail-to-Rail 8-SOIC; Manufacturer: Texas Instruments; Type: SMD; Package: 8SOIC; PartNumber: LM7322MAX/NOPB; Price1: 2.58000; Price1000: 1.18193; Link: https://www.digikey.com/product-detail/en/texas-instruments/LM7322MAX-NOPB/296-35309-1-ND/3739017; Price100: 1.75100; Price10: 2.32000
U7 = ESP-01: WiFi 802.11b/g/n Transceiver Module 2.4GHz ~ 2.48GHz Integrated, Trace Through Hole; Manufacturer: Seeed Technology Co., Ltd; Availablity: Available; Alternative: *; Type: THT; Link: https://www.digikey.com/product-detail/en/seeed-technology-co-ltd/317060016/1597-1145-ND/5774757; PartNumber: 317060016; Footprint: =Footprint; Price1: 7.09000; Price10: 7.09000; Price100: 7.09000; Price1000: 7.09000; Value: *
U9 = Opto_H11AA1: Optoisolator Transistor with Base Output 4170Vrms 1 Channel 6-SMD; Manufacturer: ON Semiconductor; Type: SMD; Package: 6-SMD; PartNumber: H11AA1SM; Price1: 0.88000; Price1000: 0.29325; Link: https://www.digikey.com/product-detail/en/on-semiconductor/H11AA1SM/H11AA1SM-ND/1053619; Price100: 0.43990; Price10: 0.68400

## Sheet [04] - IC_Power_Monitor_v0.2.SchDoc
size A4
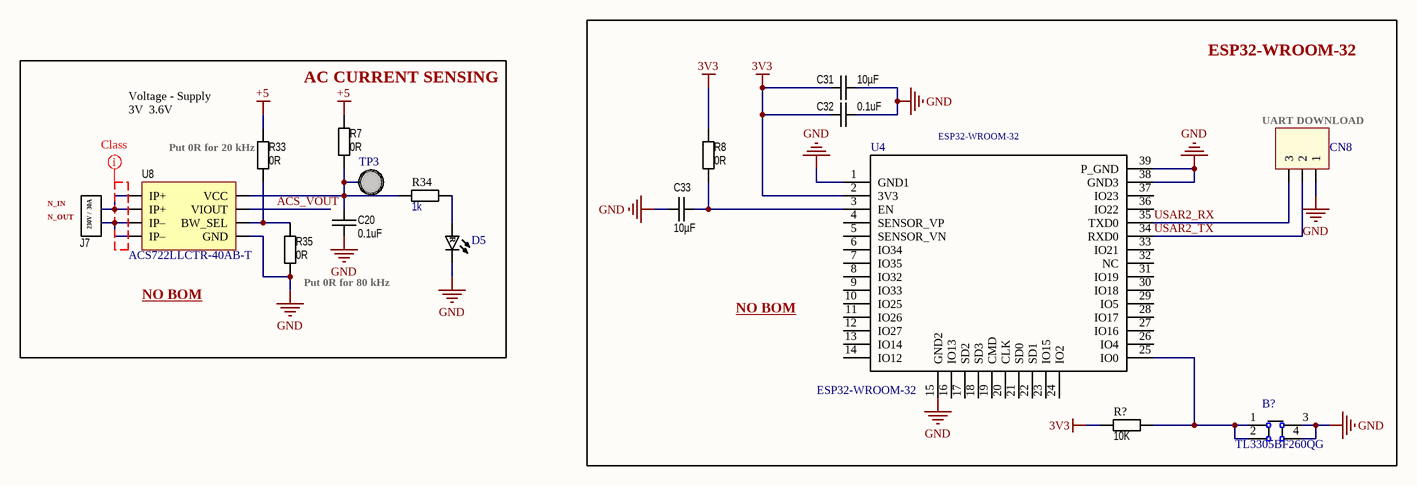
[diagram p3: [04] - IC_Power_Monitor_v0.2.SchDoc]

### Parts
B?  TL3305BF260QG  [Switch]
C20  value 0.1uF  [CAP 0603/1608]  (hidden comment: C0603C104M5RACTU)
C31  value 10µF  [CAP 0603/1608]  (hidden comment: GRM188R61E106MA73D)
C32  value 0.1uF  [CAP 0603/1608]  (hidden comment: C0603C104M5RACTU)
C33  value 10µF  [CAP 0603/1608]  (hidden comment: GRM188R61E106MA73D)
CN8  87220-3  [Terminal_3]  (value not drawn)  (no BOM)
D5  SML-D12U1WT86  [LED-0603]  (value not drawn)
J7  1868076  [30Amp_Connector]  (value not drawn)
R7  value 0R  [R0603]  (hidden comment: RES 0R 0603 JUMPER)
R8  value 0R  [R0603]  (hidden comment: RES 0R 0603 JUMPER)
R33  value 0R  [R0603]  (hidden comment: RES 0R 0603 JUMPER)
R34  value 1k  [R0603]  (hidden comment: RES SMD 1K OHM 5% 1/10W 0603)
R35  value 0R  [R0603]  (hidden comment: RES 0R 0603 JUMPER)
R?  value 10K  [R0603]  (hidden comment: ESR03EZPF1002)
TP3  Test_Point  [TP]  (value not drawn)  (no BOM)
U4  ESP32-WROOM-32  [ESP32-WROOM-32]  (no BOM)
U8  ACS722LLCTR-40AB-T  [SOIC-8]  (no BOM)

### Blocks framed on the sheet
ESP32-WROOM-32: B? C31-C33 CN8 R8 R? U4
AC CURRENT SENSING: C20 D5 J7 R7 R33-R35 TP3 U8

### Nets
3V3: C31.2 C32.1 R8.1 R?.1 U4.2(3V3)
+5: R7.1 R33.1
GND: B?.3 B?.4 C20.2 C31.1 C32.2 C33.1 CN8.1 D5.1 R35.2 U4.1(GND1) U4.15(GND2) U4.38(GND3) U4.39(P_GND) U8.5(GND)
ACS_VOUT: U8.7(VIOUT)
USAR2_RX: CN8.3 U4.35(TXD0)
USAR2_TX: CN8.2 U4.34(RXD0)
NetB?_1: B?.1 B?.2 R?.2 U4.25(IO0)
NetC20_1: C20.1 R7.2 R34.1 TP3.1 U8.8(VCC)
NetC33_2: C33.2 R8.2 U4.3(EN)
NetD5_2: D5.2 R34.2
NetJ7_1: J7.1 U8.3(IP–) U8.4(IP–)
NetJ7_2: J7.2 U8.1(IP+) U8.2(IP+)
NetR33_2: R33.2 R35.1 U8.6(BW_SEL)

Not connected (* = marked no-connect by the designer): U4 4(SENSOR_VP) 5(SENSOR_VN) 6(IO34) 7(IO35) 8(IO32) 9(IO33) 10(IO25) 11(IO26) 12(IO27) 13(IO14) 14(IO12) 16(IO13) 17(SD2) 18(SD3) 19(CMD) 20(CLK) 21(SD0) 22(SD1) 23(IO15) 24(IO2) 26(IO4) 27(IO16) 28(IO17) 29(IO5) 30(IO18) 31(IO19) 32(NC) 33(IO21) 36(IO22) 37(IO23)

### Layout directives
net class creepage: (no net found under the mark)

### Notes on the sheet
- Voltage - Supply	3V  3.6V
- (near CN8) UART DOWNLOAD
- (near J7) N_IN
- (near R33) Put 0R for 20 kHz
- (near J7) N_OUT
- NO BOM
- (near R35) Put 0R for 80 kHz
- (in symbol LED_RED) R
- (in symbol TERM_BLK_02_30A) 230V /  30A

### Library data of the parts
B? = SWITCH: as B1 on sheet [01] - Processor; Alternative: *; PartNumber: TL3305BF260QG; Price1: 0.22000; Value: *; Price10: 0.21400; Type: TH; Price100: 0.18790; Footprint: =footprintt; Link: https://www.digikey.com/product-detail/en/e-switch/TL3305BF260QG/EG5354CT-ND/5816199
C20 C32 = CAPC_0.1uF_0603_50V: as C18 on sheet [03] - General_Part; Package: 0603; PartNumber: C0603C104M5RACTU; Price1: 0.10000; Price1000: 0.00974; Link: https://www.digikey.com/product-detail/en/kemet/C0603C104M5RACTU/399-7845-1-ND/3471568; Tolerance: ±20%; Price100: 0.01740; Voltage: 50V; Price10: 0.03900
C31 C33 = CAPC_10uF_0603_25V: as C11 on sheet [02] - Power_Supplies; Package: 0603; PartNumber: GRM188R61E106MA73D; Price1: 0.42000; Price1000: 0.11123; Link: https://www.digikey.com/product-detail/en/murata-electronics/GRM188R61E106MA73D/490-7202-1-ND/3900486; Tolerance: ±20%; Price100: 0.17560; Voltage: 25V; Price10: 0.29300
CN8 = CONN_3POS: as CN1 on sheet [01] - Processor; Alternative: *; Package: 0.100" (2.54mm); Type: THT; Link: https://www.digikey.com/product-detail/en/te-connectivity-amp-connectors/87220-3/A26544-ND/298245; PartNumber: 87220-3; Footprint: =Footprint; Price1: 2.57000; Price10: 2.33000; Price100: 1.99710; Price1000: 1.42653; Value: *
D5 = LED_RED: as D1 on sheet [02] - Power_Supplies; Alternative: *; Footprint: =Footprint; Link: https://www.digikey.com/product-detail/en/rohm-semiconductor/SML-D12U1WT86/SML-D12U1WT86CT-ND/5843858; Package: 0603 (1608 Metric); PartNumber: SML-D12U1WT86; Availability: Available; Price1: 0.21000; Price10: 0.15500; Price100: 0.07330; Price1000: 0.03826; Value: *
J7 = TERM_BLK_02_30A: as J1 on sheet [02] - Power_Supplies; Type: TH; PartNumber: 1868076; Link: https://www.digikey.com/product-detail/en/phoenix-contact/1868076/277-5840-ND/2511066; Price1: 1.71000; Price100: 1.42740; Footprint: =Footprint; Price10: 1.66000; Price1000: 1.17914
R7 R8 R33 R35 = RES_0R_0603_JUMPER: as R5 on sheet [01] - Processor; Type: SMT; Package: 0603; Link: https://www.digikey.com/product-detail/en/yageo/RC0603JR-070RL/311-0.0GRTR-ND/726675; Price1: 0.1; Price1000: 0.00396; Price10: 0.022; Price100: 0.0088
R34 = RES_1k_0603_5%: as R13 on sheet [03] - General_Part; Type: SMD; Package: 0603; Link: https://www.digikey.com/product-detail/en/yageo/RC0603JR-071KL/311-1.0KGRCT-ND/729624; Price1: 0.10000; Price1000: 0.00347; Price100: 0.00770; Price10: 0.01900; Tolerance: ±5%
R? = RES_10K: as R1 on sheet [01] - Processor; Type: SMD; Package: 0603 (1608 Metric); PartNumber: ESR03EZPF1002; Link: https://www.digikey.com/product-detail/en/rohm-semiconductor/ESR03EZPF1002/RHM10KADCT-ND/1983753; Price1: 0.13000; Price1000: 0.02033; Alternative: *; Footprint: =Footprint; Price10: 0.12000; Price100: 0.04620; Availability: Available
U4 = ESP32-WROOM-32: Bluetooth, WiFi  Transceiver Module 2.4GHz ~ 2.5GHz  Surface Mount; Manufacturer: Espressif Systems; Alternative: *; Footprint: =Footprint; Link: https://www.digikey.com/product-detail/en/espressif-systems/ESP32-WROOM-32/1904-1010-1-ND/8544305; PartNumber: ESP32-WROOM-32; Type: SMD; Price1: 3.80000; Price10: 3.80000; Price100: 3.80000; Price1000: 3.80000; Value: *
U8 = ACS722: Current Sensor 40A 1 Channel Hall Effect, Open Loop Bidirectional 8-SOIC (0.154", 3.90mm Width); Manufacturer: Allegro MicroSystems; Type: SMD; Package: 8SOIC; PartNumber: ACS722LLCTR-40AB-T; Price1: 5.27000; Price1000: 2.24895; Link: https://www.digikey.com/product-detail/en/allegro-microsystems/ACS722LLCTR-40AB-T/620-1639-1-ND/4948875https://www.digikey.com/product-detail/en/allegro-microsystems/ACS722LLCTR-40AB-T/620-1639-1-ND/4948875https://www.digikey.com/product-detail/en/allegro-microsystems/ACS722LLCTR-40AB-T/620-1639-1-ND/4948875https://www.digikey.com/product-detail/en/allegro-microsystems/ACS722LLCTR-40AB-T/620-1639-1-ND/4948875https://www.digikey.com/product-detail/en/allegro-microsystems/ACS722LLCTR-40AB-T/620-1639-1-ND/4948875https://www.digikey.com/product-detail/en/allegro-microsystems/ACS722LLCTR-40AB-T/620-1639-1-ND/4948875https://www.digikey.com/product-detail/en/allegro-microsystems/ACS722LLCTR-40AB-T/620-1639-1-ND/4948875https://www.digikey.com/product-detail/en/allegro-microsystems/ACS722LLCTR-40AB-T/620-1639-1-ND/4948875https://www.digikey.com/product-detail/en/allegro-microsystems/ACS722LLCTR-40AB-T/620-1639-1-ND/4948875https://www.digikey.com/product-detail/en/allegro-microsystems/ACS722LLCTR-40AB-T/620-1639-1-ND/4948875https://www.digikey.com/product-detail/en/allegro-microsystems/ACS722LLCTR-40AB-T/620-1639-1-ND/4948875https://www.digikey.com/product-detail/en/allegro-microsystems/ACS722LLCTR-40AB-T/620-1639-1-ND/4948875https://www.digikey.com/product-detail/en/allegro-microsystems/ACS722LLCTR-40AB-T/620-1639-1-ND/4948875https://www.digikey.com/product-detail/en/allegro-microsystems/ACS722LLCTR-40AB-T/620-1639-1-ND/4948875https://www.digikey.com/product-detail/en/allegro-microsystems/ACS722LLCTR-40AB-T/620-1639-1-ND/4948875https://www.digikey.com/product-detail/en/allegro-microsystems/ACS722LLCTR-40AB-T/620-1639-1-ND/4948875https://www.digikey.com/product-detail/en/allegro-microsystems/ACS722LLCTR-40AB-T/620-1639-1-ND/4948875https://www.digikey.com/product-detail/en/allegro-microsystems/ACS722LLCTR-40AB-T/620-1639-1-ND/4948875https://www.digikey.com/product-detail/en/allegro-microsystems/ACS722LLCTR-40AB-T/620-1639-1-ND/4948875; Price100: 2.86940; Price10: 4.11000

## Nets that join several sheets
3V3: [01] - Processor (13 pins), [02] - Power_Supplies (7 pins), [03] - General_Part (8 pins), [04] - IC_Power_Monitor_v0.2 (5 pins)
+5: [02] - Power_Supplies (CN5.4 R42.1 R47.1), [03] - General_Part (10 pins), [04] - IC_Power_Monitor_v0.2 (R7.1 R33.1)
+12V: [02] - Power_Supplies (5 pins), [03] - General_Part (5 pins)
-12V: [02] - Power_Supplies (CN5.2 R37.1), [03] - General_Part (C21.1 U5.2)
GND: [01] - Processor (16 pins), [02] - Power_Supplies (20 pins), [03] - General_Part (33 pins), [04] - IC_Power_Monitor_v0.2 (14 pins)
ACS_VOUT: [01] - Processor (U1.20), [04] - IC_Power_Monitor_v0.2 (U8.7)
CAP_ALERT: [01] - Processor (U1.9), [03] - General_Part (IC4.1 R28.2)
CONTROL_PIN: [01] - Processor (U1.22), [03] - General_Part (U5.3)
FEEDBACK: [01] - Processor (U1.14), [03] - General_Part (R17.2 R18.1 R22.2 TP6.1)
GFCI_INT: [01] - Processor (U1.11), [03] - General_Part (D2.C R21.1 TP5.1)
GFCI_TEST: [01] - Processor (U1.15), [03] - General_Part (R46.2)
I2C1_SCL: [01] - Processor (CN3.2 R2.2 U1.58), [03] - General_Part (CN10.2 IC3.2 IC4.3)
I2C1_SDA: [01] - Processor (CN3.1 R1.2 U1.59), [03] - General_Part (CN10.3 IC3.1 IC4.2)
RLY1: [01] - Processor (U1.37), [03] - General_Part (R27.1)
Sense_Out: [01] - Processor (U1.10), [03] - General_Part (C15.1 R23.2 U9.5)
TEMP_ALERT: [01] - Processor (U1.8), [03] - General_Part (IC3.3 R29.1)
USAR1_RX: [01] - Processor (U1.43), [03] - General_Part (CN11.2 U7.8)
USAR1_TX: [01] - Processor (U1.42), [03] - General_Part (CN11.3 U7.4)
USAR2_RX: [01] - Processor (U1.17), [04] - IC_Power_Monitor_v0.2 (CN8.3 U4.35)
USAR2_TX: [01] - Processor (U1.16), [04] - IC_Power_Monitor_v0.2 (CN8.2 U4.34)

## Assembly variants
Variant of EVSE_Controller_v0.1: not fitted C15 C16 C22 C30 CN8 CN9 J4 R23 R25 U7
Variant of EVSE_Controller_v0.1_1: all parts fitted